# Altium schematic sheet Outputs.SchDoc: Carte Découpe DMX
size A4
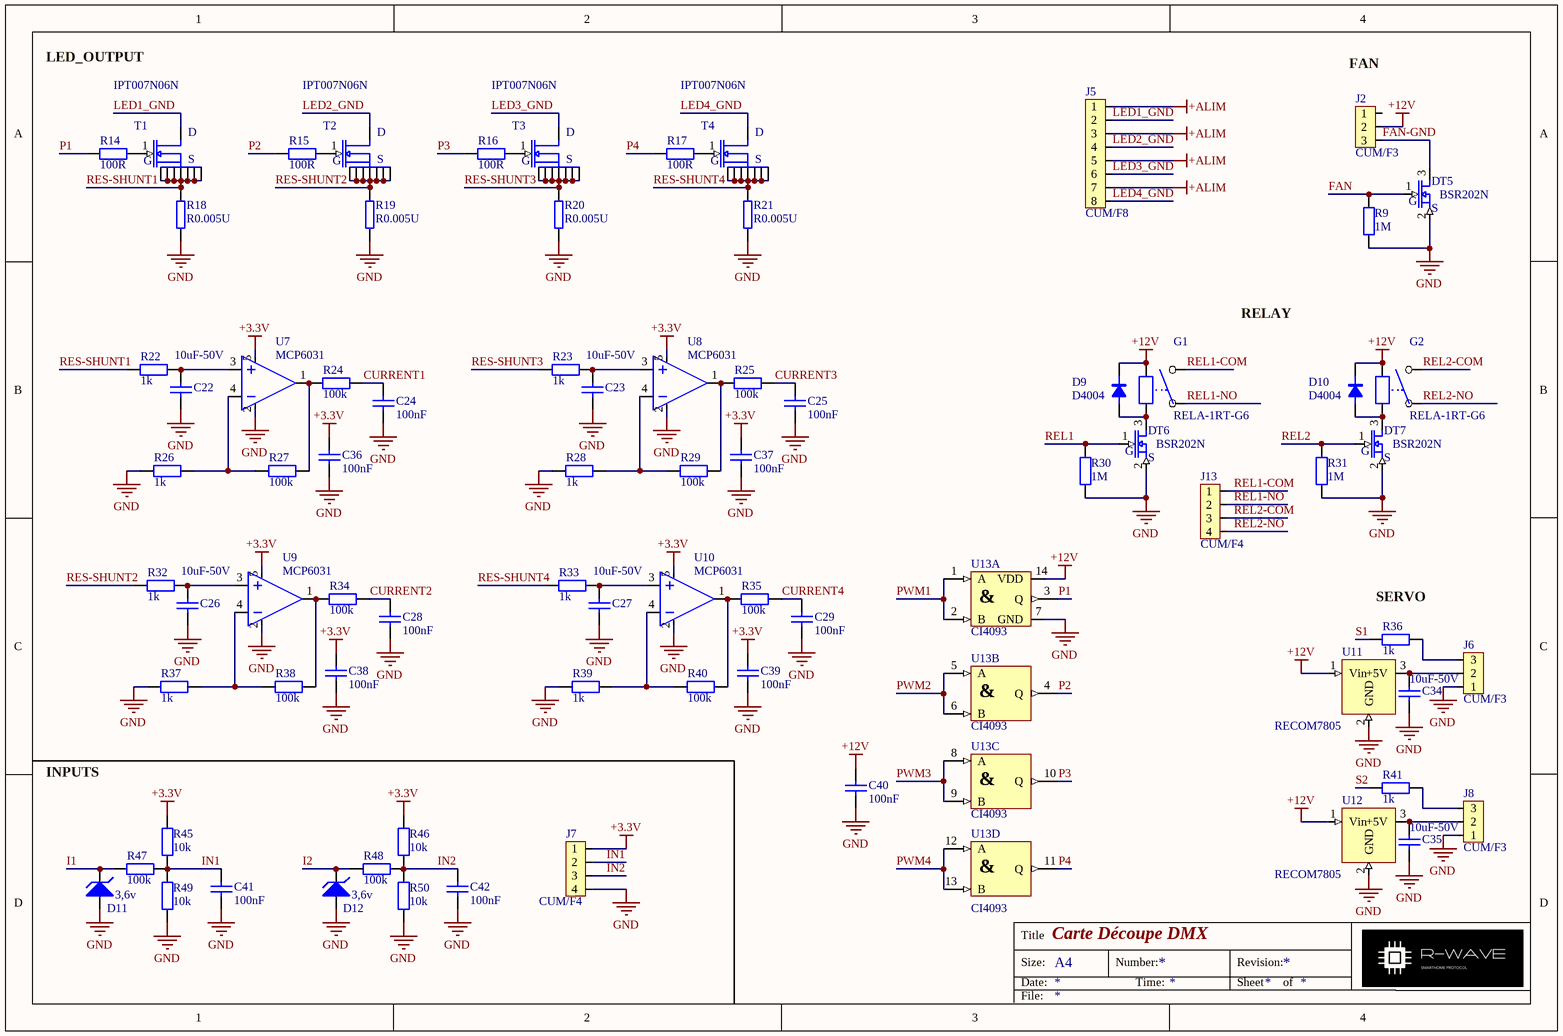
[diagram p0: Outputs.SchDoc]

## Parts
C22  10uF-50V  [C1206]
C23  10uF-50V  [C1206]
C24  100nF  [C0603]
C25  100nF  [C0603]
C26  10uF-50V  [C1206]
C27  10uF-50V  [C1206]
C28  100nF  [C0603]
C29  100nF  [C0603]
C34  10uF-50V  [C1206]
C35  10uF-50V  [C1206]
C36  100nF  [C0603]
C37  100nF  [C0603]
C38  100nF  [C0603]
C39  100nF  [C0603]
C40  100nF  [C0603]
C41  100nF  [C0603]
C42  100nF  [C0603]
D9  D4004  [DIO4004A]
D10  D4004  [DIO4004A]
D11  3,6v  [SOD123]
D12  3,6v  [SOD123]
G1  RELA-1RT-G6  [RELG6D1A]
G2  RELA-1RT-G6  [RELG6D1A]
J2  CUM/F3  [HDR1X3]
J5  CUM/F8  [CNT8C3]
J6  CUM/F3  [HDR1X3]
J7  CUM/F4  [CNT4J]
J8  CUM/F3  [HDR1X3]
J13  CUM/F4  [CNT4F0]
R9  1M  [R0603]
R14  100R  [R0603]
R15  100R  [R0603]
R16  100R  [R0603]
R17  100R  [R0603]
R18  R0.005U  [RCER005]
R19  R0.005U  [RCER005]
R20  R0.005U  [RCER005]
R21  R0.005U  [RCER005]
R22  1k  [R0603]
R23  1k  [R0603]
R24  100k  [R0603]
R25  100k  [R0603]
R26  1k  [R0603]
R27  100k  [R0603]
R28  1k  [R0603]
R29  100k  [R0603]
R30  1M  [R0603]
R31  1M  [R0603]
R32  1k  [R0603]
R33  1k  [R0603]
R34  100k  [R0603]
R35  100k  [R0603]
R36  1k  [R0603]
R37  1k  [R0603]
R38  100k  [R0603]
R39  1k  [R0603]
R40  100k  [R0603]
R41  1k  [R0603]
R45  10k  [R0603]
R46  10k  [R0603]
R47  100k  [R0603]
R48  100k  [R0603]
R49  10k  [R0603]
R50  10k  [R0603]
T1  IPT007N06N  [TRA007]
T2  IPT007N06N  [TRA007]
T3  IPT007N06N  [TRA007]
T4  IPT007N06N  [TRA007]
T5  BSR202N  [TRA202]
T6  BSR202N  [TRA202]
T7  BSR202N  [TRA202]
U7  MCP6031  [CIA6031]
U8  MCP6031  [CIA6031]
U9  MCP6031  [CIA6031]
U10  MCP6031  [CIA6031]
U11  RECOM7805  [REG5VG]
U12  RECOM7805  [REG5VG]
U13  CI4093  [CIL4093]  (parts A,B,C,D of 4)

## Nets
+3.3V: C36.2 C37.2 C38.2 C39.2 J7.1 R45.1 R46.1 U7.5(VDD) U8.5(VDD) U9.5(VDD) U10.5(VDD)
+12V: C40.2 D9.1 D10.1 G1.7 G2.7 J2.2 U11.1(Vin) U12.1(Vin) U13.14(VDD)
+ALIM: J5.1 J5.3 J5.5 J5.7
GND: C22.1 C23.1 C24.2 C25.2 C26.1 C27.1 C28.2 C29.2 C34.1 C35.1 C36.1 C37.1 C38.1 C39.1 C40.1 C41.1 C42.1 D11.1(A) D12.1(A) J6.1 J7.4 J8.1 R9.1 R18.1 R19.1 R20.1 R21.1 R26.2 R28.2 R30.1 R31.1 R37.2 R39.2 R49.2 R50.2 T5.2(S) T6.2(S) T7.2(S) U7.2(VSS) U8.2(VSS) U9.2(VSS) U10.2(VSS) U11.2(GND) U12.2(GND) U13.7(GND)
CURRENT1: C24.1 R24.1
CURRENT2: C28.1 R34.1
CURRENT3: C25.1 R25.1
CURRENT4: C29.1 R35.1
FAN: R9.2 T5.1(G)
FAN-GND: J2.3 T5.3(D)
I1: D11.2(K) R47.2
I2: D12.2(K) R48.2
IN1: C41.2 J7.2 R45.2 R47.1 R49.1
IN2: C42.2 J7.3 R46.2 R48.1 R50.1
LED1_GND: J5.2 T1.9
LED2_GND: J5.4 T2.9
LED3_GND: J5.6 T3.9
LED4_GND: J5.8 T4.9
P1: R14.2 U13.3(Q)
P2: R15.2 U13.4(Q)
P3: R16.2 U13.10(Q)
P4: R17.2 U13.11(Q)
PWM1: U13.1(A) U13.2(B)
PWM2: U13.5(A) U13.6(B)
PWM3: U13.8(A) U13.9(B)
PWM4: U13.12(A) U13.13(B)
REL1: R30.2 T6.1(G)
REL1-COM: G1.2 J13.1
REL1-NO: G1.3 J13.2
REL2: R31.2 T7.1(G)
REL2-COM: G2.2 J13.3
REL2-NO: G2.3 J13.4
RES-SHUNT1: R18.2 R22.2 T1.2 T1.3 T1.4 T1.5 T1.6 T1.7 T1.8
RES-SHUNT2: R19.2 R32.2 T2.2 T2.3 T2.4 T2.5 T2.6 T2.7 T2.8
RES-SHUNT3: R20.2 R23.2 T3.2 T3.3 T3.4 T3.5 T3.6 T3.7 T3.8
RES-SHUNT4: R21.2 R33.2 T4.2 T4.3 T4.4 T4.5 T4.6 T4.7 T4.8
S1: R36.2
S2: R41.2
NetC22_2: C22.2 R22.1 U7.3(Vin+)
NetC23_2: C23.2 R23.1 U8.3(Vin+)
NetC26_2: C26.2 R32.1 U9.3(Vin+)
NetC27_2: C27.2 R33.1 U10.3(Vin+)
NetC34_2: C34.2 J6.2 U11.3(+5V)
NetC35_2: C35.2 J8.2 U12.3(+5V)
NetD9_2: D9.2 G1.8 T6.3(D)
NetD10_2: D10.2 G2.8 T7.3(D)
NetJ6_3: J6.3 R36.1
NetJ8_3: J8.3 R41.1
NetR14_1: R14.1 T1.1
NetR15_1: R15.1 T2.1
NetR16_1: R16.1 T3.1
NetR17_1: R17.1 T4.1
NetR24_2: R24.2 R27.1 U7.1(Vout)
NetR25_2: R25.2 R29.1 U8.1(Vout)
NetR26_1: R26.1 R27.2 U7.4(Vin-)
NetR28_1: R28.1 R29.2 U8.4(Vin-)
NetR34_2: R34.2 R38.1 U9.1(Vout)
NetR35_2: R35.2 R40.1 U10.1(Vout)
NetR37_1: R37.1 R38.2 U9.4(Vin-)
NetR39_1: R39.1 R40.2 U10.4(Vin-)

Not connected (* = marked no-connect by the designer): J2 1

## Notes on the sheet
- LED_OUTPUT
- (near J2) FAN
- RELAY
- (near R36) SERVO
- INPUTS
- Title
- Size:
- Date:
- A4
- Number:
- Time:
- Revision:
- Sheet
- of
- File:
- (in symbol CI4093, part A) &
- (in symbol CI4093, part B) &
- (in symbol CI4093, part C) &
- (in symbol CI4093, part D) &
- (in symbol IPT007N06N) D; G; S

## Library data of the parts
C22-C29 C34-C42 = Cap: Capacitor
  C22 C23 C26 C27 C34 C35: Value: 10uF-50V
  C24 C25 C28 C29 C36-C42: Value: 100nF
D9 D10 = D4004: DIODE CMS 1A 400V  boitier DO214AC
D11 D12 = D Zener: Zener Diode; Value: 3,6v
G1 G2 = RELA-1RT-G6: RELAIS 1RT 12V
J2 J6 J8 = CUM/F3: connecteur 3 points
J5 = CUM/F8: connecteur 8 points
J7 J13 = CUM/F4: connecteur  4 points
R9 R14-R17 R22-R41 R45-R50 = Res: Thin Metal Film Resistor
  R9 R30 R31: Value: 1M
  R14-R17: Value: 100R
  R22 R23 R26 R28 R32 R33 R36 R37 R39 R41: Value: 1k
  R24 R25 R27 R29 R34 R35 R38 R40 R47 R48: Value: 100k
  R45 R46 R49 R50: Value: 10k
R18-R21 = R0.005U: Resistance 0.005U 1W 1% CMS BOITIER 2512
T1-T4 = IPT007N06N: TRANSISTOR MOS N
T5-T7 = BSR202N: TRANSISTOR MOS N
U7-U10 = MCP6031: SOT23
U11 U12 = RECOM7805: Régulateur à piquer recom
U13 = CI4093: Quad NAND gate